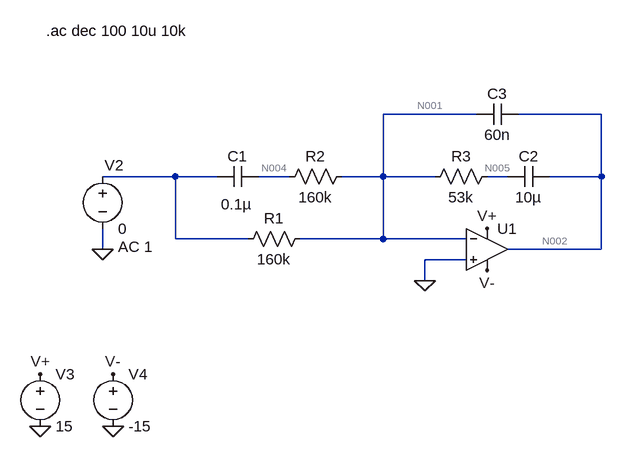
[diagram p0: schematic PID Stage.asc]
PID Stage.asc, the LTspice schematic file:
Version 4
SHEET 1 884 680
WIRE 608 -80 464 -80
WIRE 800 -80 672 -80
WIRE 144 16 32 16
WIRE 208 16 144 16
WIRE 320 16 272 16
WIRE 464 16 464 -80
WIRE 464 16 400 16
WIRE 544 16 464 16
WIRE 656 16 624 16
WIRE 800 16 800 -80
WIRE 800 16 720 16
WIRE 144 112 144 16
WIRE 256 112 144 112
WIRE 464 112 464 16
WIRE 464 112 336 112
WIRE 592 112 464 112
WIRE 32 128 32 96
WIRE 800 128 800 16
WIRE 800 128 656 128
WIRE 592 144 528 144
WIRE 528 176 528 144
FLAG 32 128 0
FLAG -64 400 0
FLAG 48 400 0
FLAG 624 96 V+
FLAG -64 320 V+
FLAG 624 160 V-
FLAG 48 320 V-
FLAG 528 176 0
SYMBOL res 352 96 R90
WINDOW 0 0 56 VBottom 2
WINDOW 3 32 56 VTop 2
SYMATTR InstName R1
SYMATTR Value 160k
SYMBOL res 416 0 R90
WINDOW 0 0 56 VBottom 2
WINDOW 3 32 56 VTop 2
SYMATTR InstName R2
SYMATTR Value 160k
SYMBOL res 640 0 R90
WINDOW 0 0 56 VBottom 2
WINDOW 3 32 56 VTop 2
SYMATTR InstName R3
SYMATTR Value 53k
SYMBOL cap 272 0 R90
WINDOW 0 0 32 VBottom 2
WINDOW 3 43 34 VTop 2
SYMATTR InstName C1
SYMATTR Value 0.1µ
SYMBOL cap 720 0 R90
WINDOW 0 0 32 VBottom 2
WINDOW 3 32 32 VTop 2
SYMATTR InstName C2
SYMATTR Value 10µ
SYMBOL cap 672 -96 R90
WINDOW 0 0 32 VBottom 2
WINDOW 3 32 32 VTop 2
SYMATTR InstName C3
SYMATTR Value 60n
SYMBOL voltage 32 0 R0
WINDOW 123 24 124 Left 2
WINDOW 39 0 0 Left 0
WINDOW 0 3 -1 Left 2
SYMATTR Value2 AC 1
SYMATTR InstName V2
SYMATTR Value 0
SYMBOL OpAmps\\UniversalOpAmp 624 128 R0
SYMATTR InstName U1
SYMBOL voltage -64 304 R0
WINDOW 123 0 0 Left 0
WINDOW 39 0 0 Left 0
SYMATTR InstName V3
SYMATTR Value 15
SYMBOL voltage 48 304 R0
WINDOW 123 0 0 Left 0
WINDOW 39 0 0 Left 0
SYMATTR InstName V4
SYMATTR Value -15
TEXT -55 -208 Left 2 !.ac dec 100 10u 10k

The netlist it stands for:
* PID Stage.asc
R1 N001 N003 160k
R2 N001 N004 160k
R3 N005 N001 53k
C1 N004 N003 0.1µ
C2 N002 N005 10µ
C3 N002 N001 60n
V2 N003 0 0 AC 1
XU1 0 N001 V+ V- N002 level1 Avol=1Meg GBW=10Meg Vos=0 En=0 Enk=0 In=0 Ink=0 Rin=500Meg  ; pins In+ In- V+ V- OUT
V3 V+ 0 15
V4 V- 0 -15
.ac dec 100 10u 10k
.lib UniversalOpAmp1.lib
.backanno
.end

* Results of the author's LTspice run, read from the files saved beside the schematic
* Operating Point, zero values left out:
*   V(v+) = 15 V
*   V(v-) = -15 V
*   I(V4) = 30 nA
*   I(V3) = -30 nA
*   Ix(u1:3) = 30 nA
*   Ix(u1:4) = -30 nA
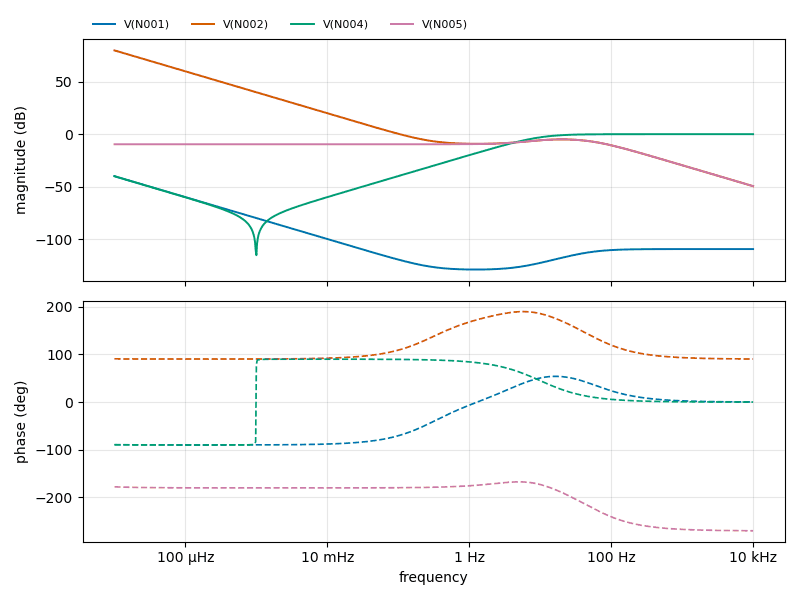
[diagram p1: AC Analysis of PID Stage.asc, plotted from the saved traces]
* AC Analysis, 1 run:
*   V(N001): -40.10 dB at 10 µHz, -109.59 dB at 10 kHz, peak -40.10 dB at 10 µHz, 3 dB below the peak at 14.14 µHz
*   V(N002): 79.90 dB at 10 µHz, -49.59 dB at 10 kHz, peak 79.90 dB at 10 µHz, 3 dB below the peak at 14.14 µHz
*   V(N004): -40.10 dB at 10 µHz, -0.00 dB at 10 kHz, peak -0.00 dB at 10 kHz, 3 dB below the peak at 9.948 Hz
*   V(N005): -9.65 dB at 10 µHz, -49.59 dB at 10 kHz, peak -4.96 dB at 19.95 Hz, 3 dB below the peak at 4.349 Hz and 65.13 Hz